# Altium schematic sheet 07_RS485.SchDoc: RS485
size 420 x 297 mm; Author: Ульянов А.В.; Address1: Address1; Address2: Address2; Address3: Address3; Address4: Address4; DocumentNumber: RS485 ISO; SheetNumber: 6; SheetTotal: 11; Scale: 1:1; Title2str: Изолированный; DocumentType: Схема электрическая принципиальная; FirstReferrence: АБВГ.123456.001
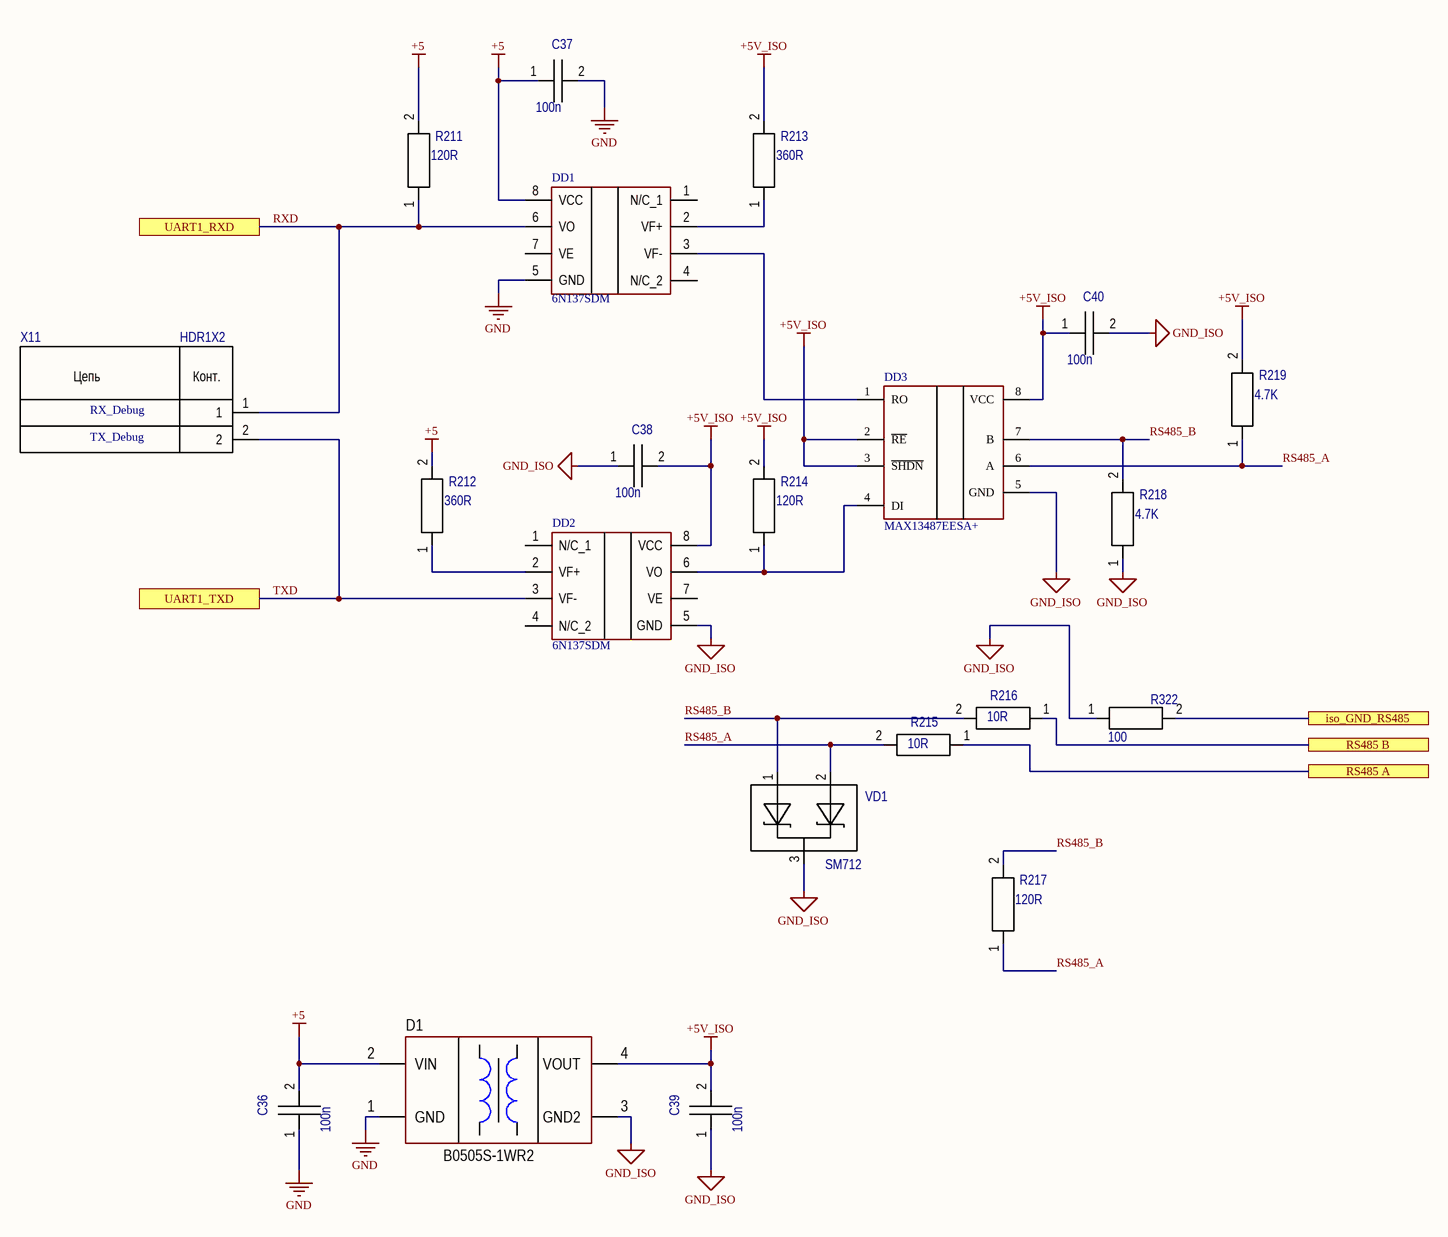
[diagram p0: 07_RS485.SchDoc]

## Parts
C36  value 100n  [C0603]  (hidden comment: C0603)
C37  value 100n  [C0603]  (hidden comment: C0603)
C38  value 100n  [C0603]  (hidden comment: C0603)
C39  value 100n  [C0603]  (hidden comment: C0603)
C40  value 100n  [C0603]  (hidden comment: C0603)
D1  (no value)  [MOD: SIP-4 (B0505S-1W)]
DD1  6N137SDM  [SOP254P1030X508-8N]
DD2  6N137SDM  [SOP254P1030X508-8N]
DD3  MAX13487EESA+  [SOIC127P600X175-8N]
R211  value 120R  [RESC1608N]  (hidden comment: R0603)
R212  value 360R  [RESC1608N]  (hidden comment: R0603)
R213  value 360R  [RESC1608N]  (hidden comment: R0603)
R214  value 120R  [RESC1608N]  (hidden comment: R0603)
R215  value 10R  [RESC1608N]  (hidden comment: R0603)
R216  value 10R  [RESC1608N]  (hidden comment: R0603)
R217  value 120R  [RESC1608N]  (hidden comment: R0603)
R218  value 4.7K  [RESC1608N]  (hidden comment: R0603)
R219  value 4.7K  [RESC1608N]  (hidden comment: R0603)
R322  value 100  [RESC3216N]  (hidden comment: R1206)
VD1  SM712  [SOT23-3N]
X11  HDR1X2  [HDR1X2]

## Ports
iso_GND_RS485, RS485 A, RS485 B, UART1_RXD, UART1_TXD

## Nets
+5: C36.2 C37.1 D1.2(VIN) DD1.8(VCC) R211.2 R212.2
+5V_ISO: C38.2 C39.2 C40.1 D1.4(VOUT) DD2.8(VCC) DD3.2(~{RE}) DD3.3(~{SHDN}) DD3.8(VCC) R213.2 R214.2 R219.2
GND: C36.1 C37.2 D1.1(GND) DD1.5(GND)
GND_ISO: C38.1 C39.1 C40.2 D1.3(GND2) DD2.5(GND) DD3.5(GND) R218.1 R322.1 VD1.3
iso_GND_RS485: R322.2 ; port iso_GND_RS485
RS485 A: R215.1 ; port RS485 A
RS485 B: R216.1 ; port RS485 B
RS485_A: DD3.6(A) R215.2 R217.1 R219.1 VD1.2
RS485_B: DD3.7(B) R216.2 R217.2 R218.2 VD1.1
RXD: DD1.6(VO) R211.1 X11.1 ; port UART1_RXD
TXD: DD2.3(VF-) X11.2 ; port UART1_TXD
NetDD1_2: DD1.2(VF+) R213.1
NetDD1_3: DD1.3(VF-) DD3.1(RO)
NetDD2_2: DD2.2(VF+) R212.1
NetDD2_6: DD2.6(VO) DD3.4(DI) R214.1

Not connected (* = marked no-connect by the designer): DD1 1(N/C_1) 4(N/C_2) 7(VE); DD2 1(N/C_1) 4(N/C_2) 7(VE)

## Notes on the sheet
- RX_Debug
- TX_Debug
- Подп. и дата
- Инв. № дубл.
- Взам. инв. №
- Инв. № подл.
- Изм.
- Лист
- № докум.
- Подп.
- Дата
- 2.106-A3
- Копировал
- Формат А3
- (in symbol HDR1X2) Цепь; Конт.

## Library data of the parts
C36-C40 = GRM188R72A104KA35D: Manufacturer: Murata Manufacturing; Код: 24; ID: Конденсатор; Power/Voltage: 100V; Tolerance: ±10%; TKE: X7R; iii: Конденсатор GRM188R72A104KA35D 100n 100V ±10% C0603 X7R  Murata Manufacturing; Comments: C0603; Part Number: GRM188R72A104KA35D; Height: 0.9; Package: C0603; TemperatureMin: -55; TemperatureMax: 125
D1 = B0505S-1WR2: DC/DC converter; Manufacturer: Mornsun; ValueManufacturerPartNumber: DC/DC converter, isolator, 5V 200mA, -40...+105°C, SIP-4; OutputType: isolator; OutputVoltage: 5V 200mA; HelpURL: https://www.chipdip.ru/product/b0505s-1wr2; Package: SIP-4; ComponentType: DC/DC converter; Temperature: -40...+105°C; PartNumber: B0505S-1WR2
DD1 DD2 = 6N137SDM: Integrated Circuit; Manufacturer_Name: ON Semiconductor; Datasheet Link: https://www.onsemi.com/pub/Collateral/HCPL2631M-D.pdf; Height: 5.08mm; PartNumber: 6N137SDM; Mouser Part Number: 512-6N137SDM; Mouser Price/Stock: https://www.mouser.co.uk/ProductDetail/ON-Semiconductor-Fairchild/6N137SDM?qs=wuRI32rFNSFC%252BTbDLj3kvw%3D%3D; Arrow Part Number: 6N137SDM; Arrow Price/Stock: https://www.arrow.com/en/products/6n137sdm/on-semiconductor?region=nac
DD3 = MAX13487EESA+: Integrated Circuit; Manufacturer_Name: Maxim Integrated; Datasheet Link: http://docs-emea.rs-online.com/webdocs/13e4/0900766b813e41ed.pdf; Height: 1.75mm; PartNumber: MAX13487EESA+; Mouser Part Number: 700-MAX13487EESA; Mouser Price/Stock: https://www.mouser.co.uk/ProductDetail/Maxim-Integrated/MAX13487EESA%2b?qs=1THa7WoU59G338ZrcGWwYw%3D%3D
R211 R214 R217 = RC0603FK-0710KL: Part Number: RC0603FR-07120RL; Manufacturer: Тайвань; Код: 26; ID: Резистор; Power/Voltage: 0.063W/50V; Tolerance: ±1%; iii: Резистор RC0603FK-0710KL 10k 0.063W/50V ±1% R0603  Тайвань; Comments: R0603; Package: R0603; TemperatureMin: -55; TemperatureMax: 155
R212 R213 = RC0603FK-0710KL: Part Number: RC0603FR-07360RL; Manufacturer: Тайвань; Код: 26; ID: Резистор; Power/Voltage: 0.063W/50V; Tolerance: ±1%; iii: Резистор RC0603FK-0710KL 10k 0.063W/50V ±1% R0603  Тайвань; Comments: R0603; Package: R0603; TemperatureMin: -55; TemperatureMax: 155
R215 R216 = RC0603FK-0710KL: Part Number: RC0603FR-0710RL; Manufacturer: Тайвань; Код: 26; ID: Резистор; Power/Voltage: 0.063W/50V; Tolerance: ±1%; iii: Резистор RC0603FK-0710KL 10k 0.063W/50V ±1% R0603  Тайвань; Comments: R0603; Package: R0603; TemperatureMin: -55; TemperatureMax: 155
R218 R219 = RC0603FK-0710KL: Part Number: RC0603FR-074K7L; Manufacturer: Тайвань; Код: 26; ID: Резистор; Power/Voltage: 0.063W/50V; Tolerance: ±1%; iii: Резистор RC0603FK-0710KL 10k 0.063W/50V ±1% R0603  Тайвань; Comments: R0603; Package: R0603; TemperatureMin: -55; TemperatureMax: 155
R322 = RC1206FR-070R33L: Part Number: RC1206FR-07100RL; Код: 196; ID: Резистор; Power/Voltage: 0.25W; Tolerance: ±1%; Comments: R1206; Package: R1206; iii: RC1206FR-07100RL
VD1 = SM712.TCT: Manufacturer: Semtech; Код: 32; ID: Защитный диод 2 канальный; Power/Voltage: 12V/400W; iii: Защитный диод 2 канальный SM712.TCT  12V/400W  SOT-23  Semtech; Com: SM712; Part Number: SM712.TCT; Package: SOT-23; TemperatureMin: -55; TemperatureMax: 125
X11 = HDR1X2: Manufacturer: Dinkle Enterprise; Код: 12; ID: Коннектор; iii: Коннектор HDR1X2      Dinkle Enterprise; Part Number: HDR1X2